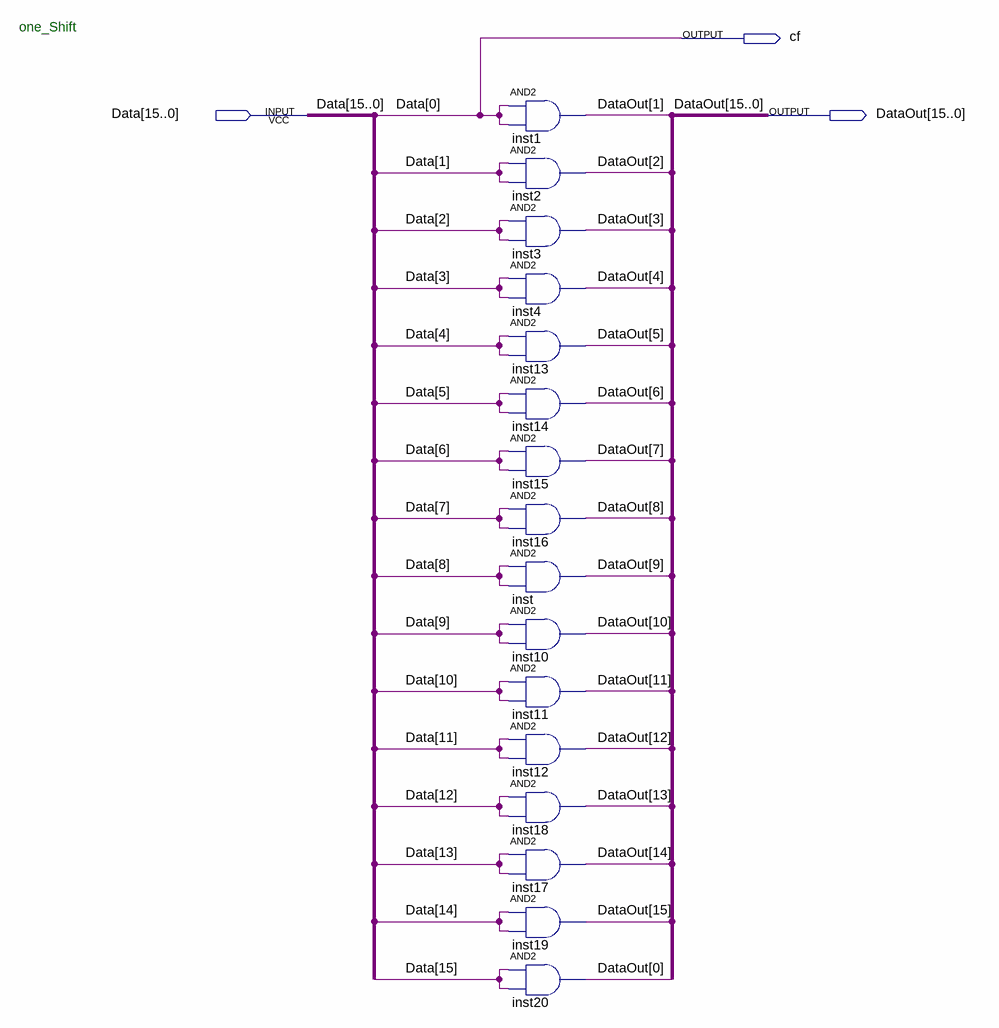
[diagram p0: schematic sheet]
// Quartus schematic oneLeftShift.bdf as structural Verilog: 16 symbols, 3 pins
module oneLeftShift (
  input  [15:0] Data,
  output cf,
  output [15:0] DataOut
);

  and inst1 (DataOut[1], Data[0], Data[0]);
  and inst2 (DataOut[2], Data[1], Data[1]);
  and inst3 (DataOut[3], Data[2], Data[2]);
  and inst4 (DataOut[4], Data[3], Data[3]);
  and inst13 (DataOut[5], Data[4], Data[4]);
  and inst14 (DataOut[6], Data[5], Data[5]);
  and inst15 (DataOut[7], Data[6], Data[6]);
  and inst16 (DataOut[8], Data[7], Data[7]);
  and inst (DataOut[9], Data[8], Data[8]);
  and inst10 (DataOut[10], Data[9], Data[9]);
  and inst11 (DataOut[11], Data[10], Data[10]);
  and inst12 (DataOut[12], Data[11], Data[11]);
  and inst18 (DataOut[13], Data[12], Data[12]);
  and inst17 (DataOut[14], Data[13], Data[13]);
  and inst19 (DataOut[15], Data[14], Data[14]);
  and inst20 (DataOut[0], Data[15], Data[15]);

  assign cf = Data[0];

  // Notes on the sheet:
  //   one_Shift
endmodule
